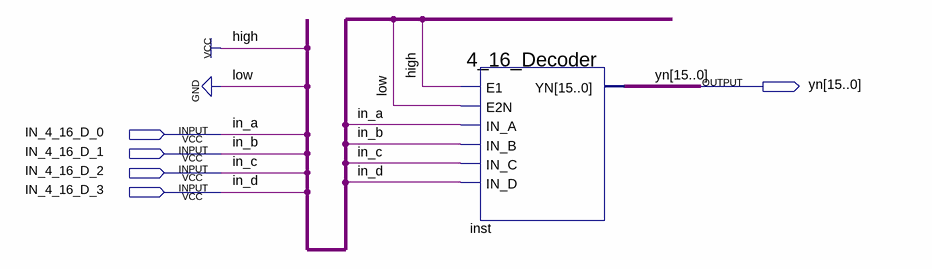
[diagram p0: schematic sheet]
// Quartus schematic TEST_4_16_DECODER.bdf as structural Verilog: 1 symbols, 5 pins
module TEST_4_16_DECODER (
  input  IN_4_16_D_0,
  input  IN_4_16_D_1,
  input  IN_4_16_D_2,
  input  IN_4_16_D_3,
  output [15:0] yn
);

  \4_16_Decoder  inst (
    .E1(1'b1), .E2N(1'b0), .IN_A(IN_4_16_D_0), .IN_B(IN_4_16_D_1), .IN_C(IN_4_16_D_2), .IN_D(IN_4_16_D_3),
    .YN(yn));

  // Other names for the same wires on the sheet: in_a = IN_4_16_D_0; in_b = IN_4_16_D_1; in_c = IN_4_16_D_2;
  //   in_d = IN_4_16_D_3
endmodule
